# Altium schematic sheet bottomBoard.SchDoc
size A4
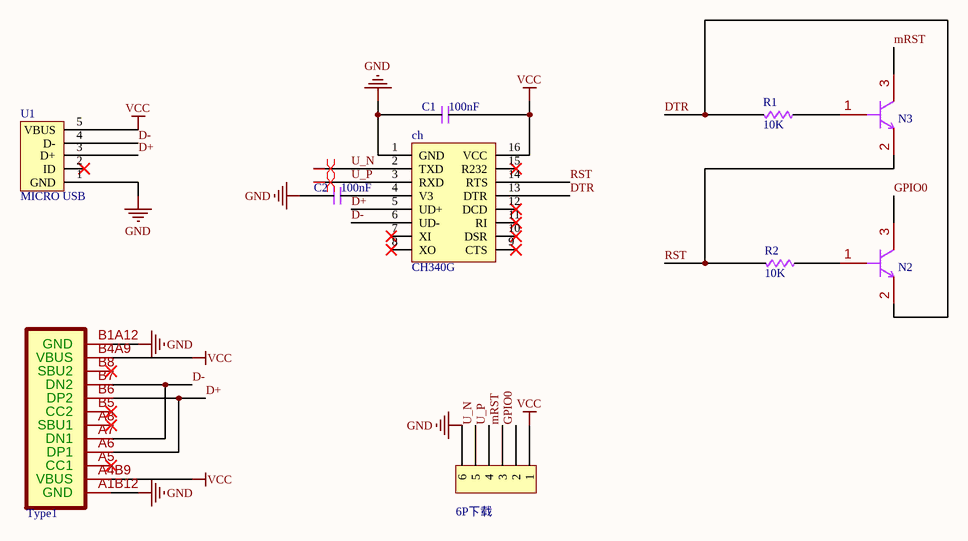
[diagram p0: bottomBoard.SchDoc]

## Parts
?  6P下载  [6P下载]
C1  value 100nF  [0603_C]  (hidden comment: 0603_C)
C2  value 100nF  [0603_C]  (hidden comment: 0603_C)
ch  CH340G  [CH340G]
N2  NPN  [SOT-23-3]  (value not drawn)
N3  NPN  [SOT-23-3]  (value not drawn)
R1  value 10K  [0603_R]  (hidden comment: 0603_R)
R2  value 10K  [0603_R]  (hidden comment: 0603_R)
Type1  typec  [TYPEC]  (value not drawn)
U1  MICRO USB  [MICRO]

## Nets
GND: ?.6 C1.1 C2.1 ch.1(GND) Type1.A1B12(GND) Type1.B1A12(GND) U1.1(GND)
VCC: ?.1 C1.2 ch.16(VCC) Type1.A4B9(VBUS) Type1.B4A9(VBUS) U1.5(VBUS)
D+: ch.5(UD+) Type1.A6(DP1) Type1.B6(DP2) U1.3(D+)
D-: ch.6(UD-) Type1.A7(DN1) Type1.B7(DN2) U1.4(D-)
DTR: ch.13(DTR) N2.2(E) R1.1
GPIO0: ?.2 N2.3(C)
mRST: ?.3 N3.3(C)
RST: ch.14(RTS) N3.2(E) R2.1
U_N: ?.5 ch.2(TXD)
U_P: ?.4 ch.3(RXD)
NetC2_2: C2.2 ch.4(V3)
NetN2_1: N2.1(B) R2.2
NetN3_1: N3.1(B) R1.2

Not connected (* = marked no-connect by the designer): ch 7(XI)* 8(XO)* 9(CTS)* 10(DSR)* 11(RI)* 12(DCD)* 15(R232)*; Type1 A5(CC1)* A8(SBU1)* B5(CC2)* B8(SBU2)*; U1 2(ID)*

## Layout directives
differential pair: U_N, U_P

## Library data of the parts
Type1 = TYPE-C